# EAGLE board cyberspace-1-mainboard (EAGLE 9.6.2), part 1 of 2
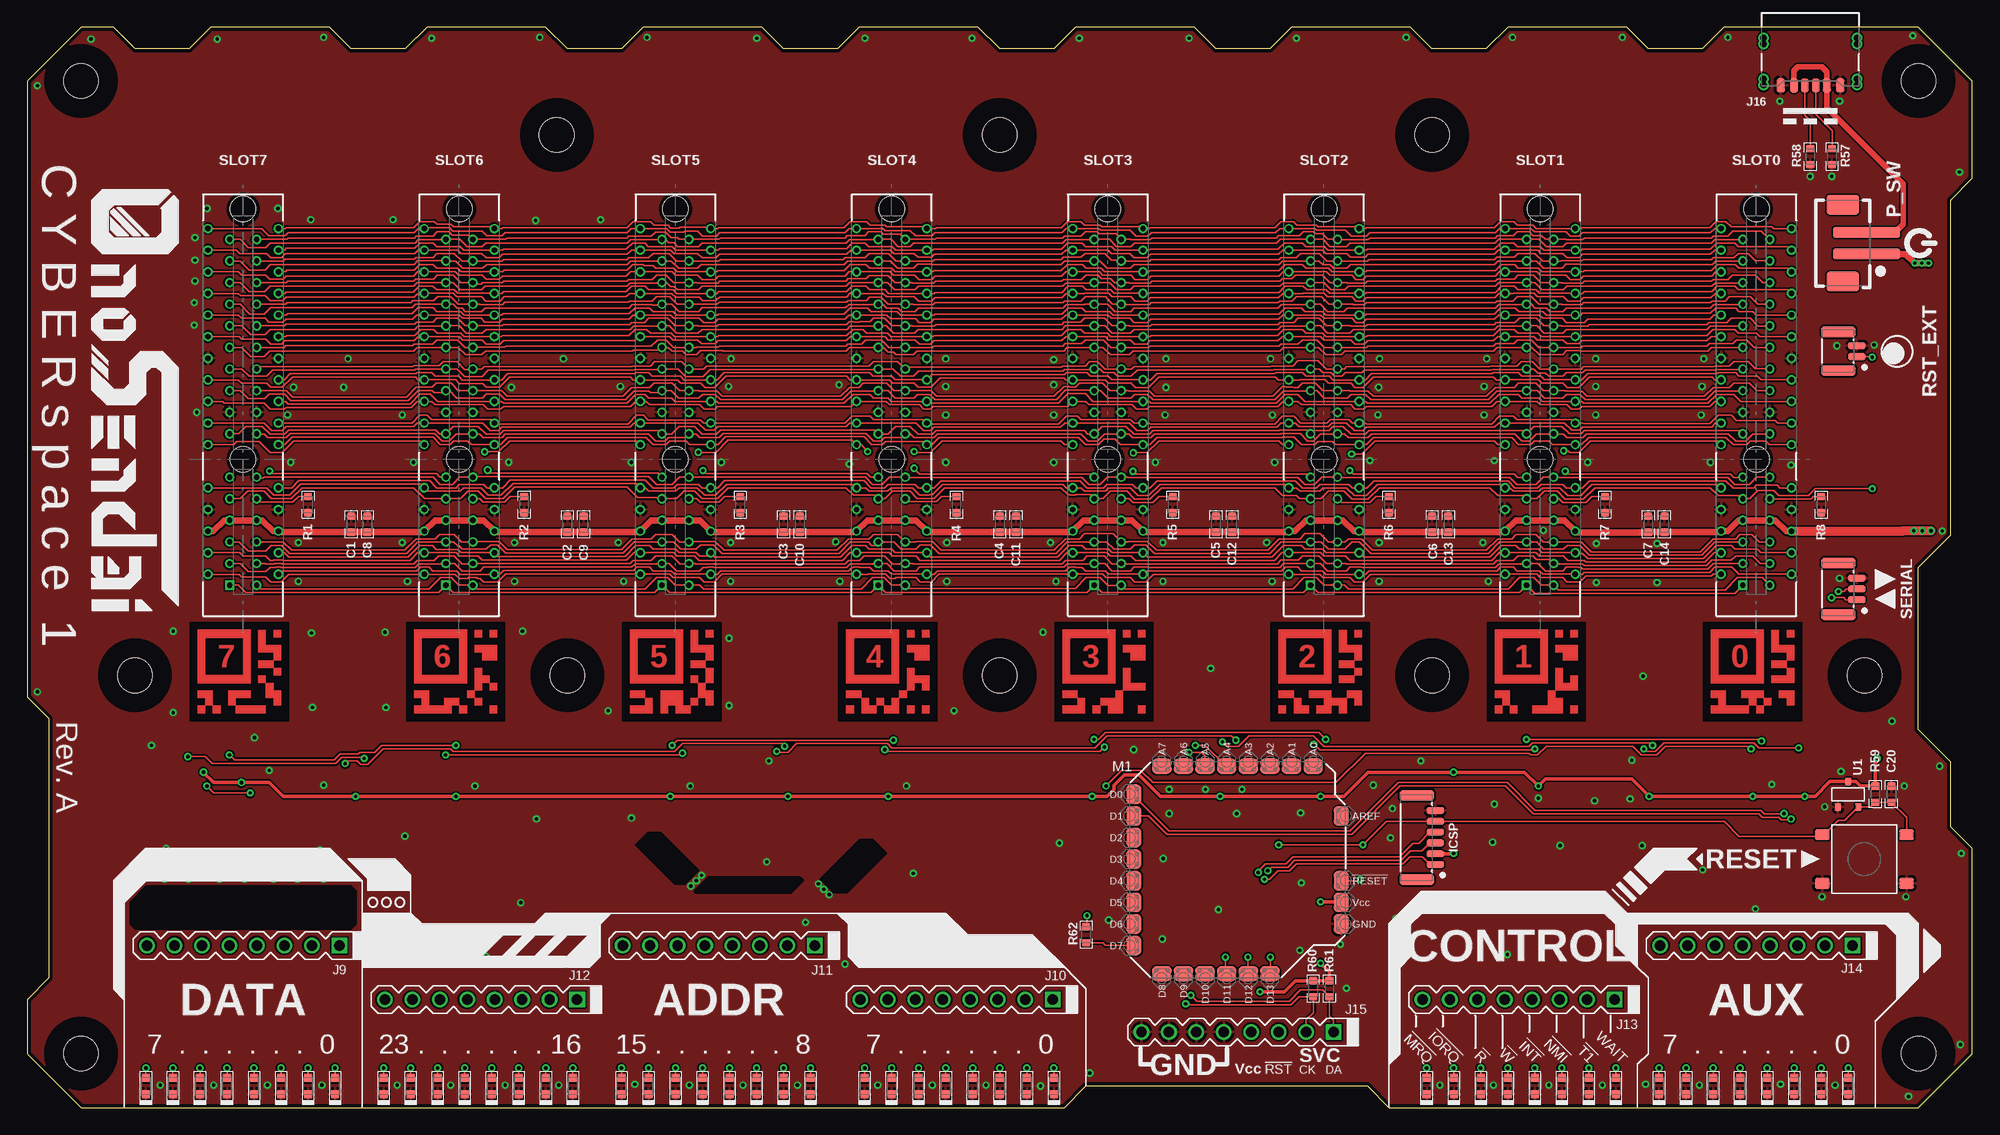
[diagram p1: board, top side]
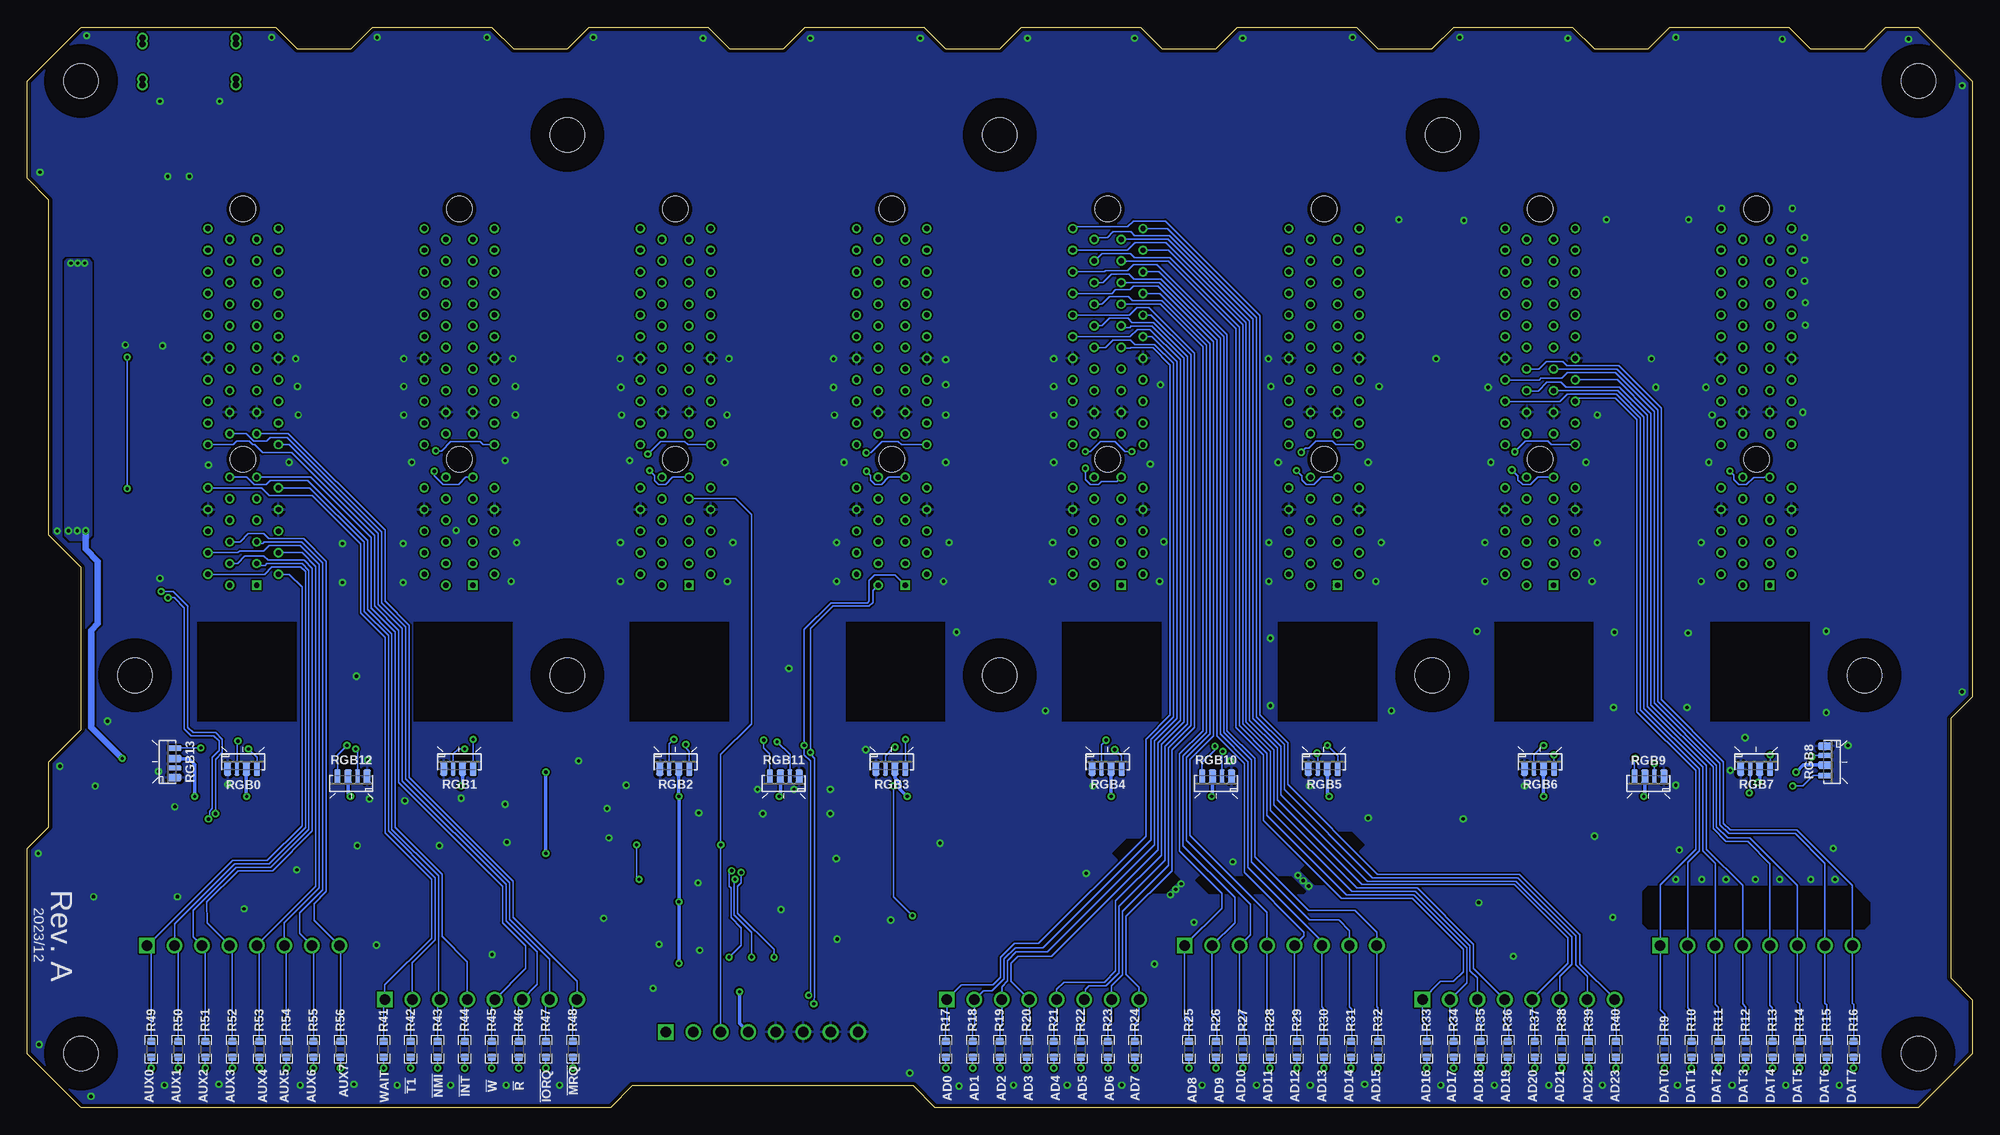
[diagram p2: board, bottom side, seen from below]

Size 180 x 100 mm. Coordinates in mm from the lower left corner, seen from the top.
Outline: 5,0 96,0 98,2 124,2 126,0 175,0 180,5 180,24 178,26 178,32 175,35 175,50 178,53 178,84 180,86 180,95 175,100 157,100 155,98 150,98 148,100 137,100 135,98 130,98 128,100 117,100 115,98 110,98 108,100 97,100 95,98 90,98 88,100 77,100 75,98 70,98 68,100 57,100 55,98 50,98 48,100 37,100 35,98 30,98 28,100 17,100 15,98 10,98 8,100 5,100 0,95 0,38 2,36 2,12 0,10 0,5 5,0
Copper layers (1*16): Top 0.0356mm / dielectric 1.5011mm / Bottom 0.0356mm
Design rules "OSH-CircuitMonkey *": minimum track width 6mil, minimum drill 12mil, track to track 6mil, track to pad 6mil, pad to pad 6mil, via to via 6mil, smd to smd 6mil, copper to edge 14mil, drill to drill 6mil, minimum pad ring 7mil, minimum via ring 7mil, stop-mask expansion 3mil, vias tented up to drill 13mil, thermal gap 10mil
Holes 3.2 mm at 5,95 175,95 175,5 5,5 50,40 90,40 130,40 170,40 10,40 130,90 90,90 49,90
tRestrict: area 6.6,36.6 to 13.4,43.4; area 1.6,1.6 to 8.4,8.4; area 1.6,91.6 to 8.4,98.4; area 45.6,86.6 to 52.4,93.4; area 86.6,86.6 to 93.4,93.4; area 126.6,86.6 to 133.4,93.4; area 171.6,91.6 to 178.4,98.4; area 166.6,36.6 to 173.4,43.4; area 126.6,36.6 to 133.4,43.4; area 86.6,36.6 to 93.4,43.4; area 46.6,36.6 to 53.4,43.4; area 171.6,1.6 to 178.4,8.4; 4 more areas
bRestrict: area 6.6,36.6 to 13.4,43.4; area 1.6,1.6 to 8.4,8.4; area 1.6,91.6 to 8.4,98.4; area 45.6,86.6 to 52.4,93.4; area 86.6,86.6 to 93.4,93.4; area 126.6,86.6 to 133.4,93.4; area 171.6,91.6 to 178.4,98.4; area 166.6,36.6 to 173.4,43.4; area 126.6,36.6 to 133.4,43.4; area 86.6,36.6 to 93.4,43.4; area 46.6,36.6 to 53.4,43.4; area 171.6,1.6 to 178.4,8.4; 4 more areas

## Footprints (pad centres in the part's own frame; a part is rotated, then mirrored left to right if it is on the bottom)
SMD_0603 = smd 0.8 x 0.8: A 0.75,0; K -0.75,0
0603-CAP = smd 0.711 x 0.762: 1 -0.752,0; 2 0.752,0
BM06B-SRSS-TB = smd 0.6 x 1.6: 1 -2.5,-0.3; 2 -1.5,-0.3; 3 -0.5,-0.3; 4 0.5,-0.3; 5 1.5,-0.3; 6 2.5,-0.3 | smd 1 x 3.2: MTG1 3.9,1.4; MTG2 -3.9,1.4
MA08X1-VT-THD = drill 0.965 square: 1 -8.89,0 | drill 0.965: 2 -6.35,0; 3 -3.81,0; 4 -1.27,0; 5 1.27,0; 6 3.81,0; 7 6.35,0; 8 8.89,0
GCT-USB4125 = smd 0.7 x 1.3: A5 -0.5,5.4; B5 0.5,5.4 | smd 0.75 x 1.3: A9 1.52,5.4; B9 -1.52,5.4 | smd 0.8 x 1.3: A12 2.75,5.4; B12 -2.75,5.4 | drill 0.6: MT1A -4.32,5.38; MT1B -4.32,4.82; MT2A 4.32,5.38; MT2B 4.32,4.82; MT3A -4.32,1.58; MT3B -4.32,1.02; MT4A 4.32,1.58; MT4B 4.32,1.02
0119A = smd 1.4 x 1.8: !RESET 9.6,-1; AREF 9.6,5; D0 -9.6,7; D1 -9.6,5; D2 -9.6,3; D3 -9.6,1; D4 -9.6,-1; D5 -9.6,-3; D6 -9.6,-5; D7 -9.6,-7; GND 9.6,-5; VCC 9.6,-3 | smd 1.8 x 1.4: A0 7,9.6; A1 5,9.6; A2 3,9.6; A3 1,9.6; A4 -1,9.6; A5 -3,9.6; A6 -5,9.6; A7 -7,9.6; D8 -7,-9.6; D9 -5,-9.6; D10 -3,-9.6; D11 -1,-9.6; D12 1,-9.6; D13 3,-9.6
B2B-PH-SM4 = smd 1 x 6.2: 1 -1,-2.2; 2 1,-2.2 | smd 1.8 x 3: GND@MT1 3.55,0; GND@MT2 -3.55,0
0603-RES = smd 0.711 x 0.762: 1 -0.752,0; 2 0.752,0
B3FS = smd 1.4 x 1: 1 3.9,-2.25; 2 -3.9,-2.25; 3 3.9,2.25; 4 -3.9,2.25
SMD_4020 = smd 0.55 x 1.3: 1 1.275,-0.65 | smd 0.7 x 1.3: 2 0.3,-0.65; 4 -1.45,-0.65 | smd 0.45 x 1.3: 3 -0.575,-0.65
BM02B-SRSS-TB = smd 0.6 x 1.6: 1 -0.5,-0.3; 2 0.5,-0.3 | smd 1 x 3.2: MTG1 1.8,1.4; MTG2 -1.8,1.4
BM03B-SRSS-TB = smd 0.6 x 1.6: 1 -1,-0.3; 2 0,-0.3; 3 1,-0.3 | smd 1 x 3.2: MTG1 2.4,1.4; MTG2 -2.4,1.4
PCIE-64P-SOCKET = drill 0.5 square: A1 -11.65,1.25 | drill 0.5: A2 -10.65,3.25; A3 -9.65,1.25; A4 -8.65,3.25; A5 -7.65,1.25; A6 -6.65,3.25; A7 -5.65,1.25; A8 -4.65,3.25; A9 -3.65,1.25; A10 -2.65,3.25; A11 -1.65,1.25; A12 1.35,3.25; A13 2.35,1.25; A14 3.35,3.25; A15 4.35,1.25; A16 5.35,3.25; A17 6.35,1.25; A18 7.35,3.25; A19 8.35,1.25; A20 9.35,3.25; A21 10.35,1.25; A22 11.35,3.25; A23 12.35,1.25; A24 13.35,3.25; A25 14.35,1.25; A26 15.35,3.25; A27 16.35,1.25; A28 17.35,3.25; A29 18.35,1.25; A30 19.35,3.25; A31 20.35,1.25; A32 21.35,3.25; B1 -11.65,-1.25; B2 -10.65,-3.25; B3 -9.65,-1.25; B4 -8.65,-3.25; B5 -7.65,-1.25; B6 -6.65,-3.25; B7 -5.65,-1.25; B8 -4.65,-3.25; B9 -3.65,-1.25; B10 -2.65,-3.25; B11 -1.65,-1.25; B12 1.35,-3.25; B13 2.35,-1.25; B14 3.35,-3.25; B15 4.35,-1.25; B16 5.35,-3.25; B17 6.35,-1.25; B18 7.35,-3.25; B19 8.35,-1.25; B20 9.35,-3.25; B21 10.35,-1.25; B22 11.35,-3.25; B23 12.35,-1.25; B24 13.35,-3.25; B25 14.35,-1.25; B26 15.35,-3.25; B27 16.35,-1.25; B28 17.35,-3.25; B29 18.35,-1.25; B30 19.35,-3.25; B31 20.35,-1.25; B32 21.35,-3.25 | hole 2.35: 0,0; 23.15,0
SOT-23 = smd 0.6 x 0.7: 1 -0.95,-1.18; 2 0.95,-1.18; 3 0,1.18

## Placement (x,y rotation side)
!INT  BLU  [SMD_0603]  139.5,2 90 top
!IORQ  BLU  [SMD_0603]  132,2 90 top
!MRQ  BLU  [SMD_0603]  129.5,2 90 top
!NMI  BLU  [SMD_0603]  142,2 90 top
!R  BLU  [SMD_0603]  134.5,2 90 top
!T1  BLU  [SMD_0603]  144.5,2 90 top
!W  BLU  [SMD_0603]  137,2 90 top
AD0  BLU  [SMD_0603]  95,2 90 top
AD1  BLU  [SMD_0603]  92.5,2 90 top
AD2  BLU  [SMD_0603]  90,2 90 top
AD3  BLU  [SMD_0603]  87.5,2 90 top
AD4  BLU  [SMD_0603]  85,2 90 top
AD5  BLU  [SMD_0603]  82.5,2 90 top
AD6  BLU  [SMD_0603]  80,2 90 top
AD7  BLU  [SMD_0603]  77.5,2 90 top
AD8  BLU  [SMD_0603]  72.5,2 90 top
AD9  BLU  [SMD_0603]  70,2 90 top
AD10  BLU  [SMD_0603]  67.5,2 90 top
AD11  BLU  [SMD_0603]  65,2 90 top
AD12  BLU  [SMD_0603]  62.5,2 90 top
AD13  BLU  [SMD_0603]  60,2 90 top
AD14  BLU  [SMD_0603]  57.5,2 90 top
AD15  BLU  [SMD_0603]  55,2 90 top
AD16  BLU  [SMD_0603]  50.5,2 90 top
AD17  BLU  [SMD_0603]  48,2 90 top
AD18  BLU  [SMD_0603]  45.5,2 90 top
AD19  BLU  [SMD_0603]  43,2 90 top
AD20  BLU  [SMD_0603]  40.5,2 90 top
AD21  BLU  [SMD_0603]  38,2 90 top
AD22  BLU  [SMD_0603]  35.5,2 90 top
AD23  BLU  [SMD_0603]  33,2 90 top
AUX0  BLU  [SMD_0603]  168.5,2 90 top
AUX1  BLU  [SMD_0603]  166,2 90 top
AUX2  BLU  [SMD_0603]  163.5,2 90 top
AUX3  BLU  [SMD_0603]  161,2 90 top
AUX4  BLU  [SMD_0603]  158.5,2 90 top
AUX5  BLU  [SMD_0603]  156,2 90 top
AUX6  BLU  [SMD_0603]  153.5,2 90 top
AUX7  BLU  [SMD_0603]  151,2 90 top
C1  1uF  [0603-CAP]  30,54 90 top
C2  1uF  [0603-CAP]  50,54 90 top
C3  1uF  [0603-CAP]  70,54 90 top
C4  1uF  [0603-CAP]  90,54 90 top
C5  1uF  [0603-CAP]  110,54 90 top
C6  1uF  [0603-CAP]  130,54 90 top
C7  1uF  [0603-CAP]  150,54 90 top
C8  0.1uF  [0603-CAP]  31.5,54 90 top
C9  0.1uF  [0603-CAP]  51.5,54 90 top
C10  0.1uF  [0603-CAP]  71.5,54 90 top
C11  0.1uF  [0603-CAP]  91.5,54 90 top
C12  0.1uF  [0603-CAP]  111.5,54 90 top
C13  0.1uF  [0603-CAP]  131.5,54 90 top
C14  0.1uF  [0603-CAP]  151.5,54 90 top
C20  0.1uF  [0603-CAP]  172.5,29 90 top
DAT0  VIO  [SMD_0603]  28.5,2 90 top
DAT1  VIO  [SMD_0603]  26,2 90 top
DAT2  VIO  [SMD_0603]  23.5,2 90 top
DAT3  VIO  [SMD_0603]  21,2 90 top
DAT4  VIO  [SMD_0603]  18.5,2 90 top
DAT5  VIO  [SMD_0603]  16,2 90 top
DAT6  VIO  [SMD_0603]  13.5,2 90 top
DAT7  VIO  [SMD_0603]  11,2 90 top
ICSP  Connector, 6P, SM, VT  [BM06B-SRSS-TB]  130,25 90 top
J9  Header, 8-pin  [MA08X1-VT-THD]  20,15 180 top
J10  Header, 8-pin  [MA08X1-VT-THD]  86,10 180 top
J11  Header, 8-pin  [MA08X1-VT-THD]  64,15 180 top
J12  Header, 8-pin  [MA08X1-VT-THD]  42,10 180 top
J13  Header, 8-pin  [MA08X1-VT-THD]  138,10 180 top
J14  Header, 8-pin  [MA08X1-VT-THD]  160,15 180 top
J15  Header, 8-pin  [MA08X1-VT-THD]  112,7 180 top
J16  USB-C, Power  [GCT-USB4125]  165,100 180 top
M1  ATmega328P Module  [0119A]  112,22 0 top
P_SW  2-pin, VT, SMT  [B2B-PH-SM4]  168,80 90 top
QR00  QR_CODE-00-7MM  [QR-7MM-00]  160,40 0 top
QR01  QR_CODE-01-7MM  [QR-7MM-01]  140,40 0 top
QR02  QR_CODE-02-7MM  [QR-7MM-02]  120,40 0 top
QR03  QR_CODE-03-7MM  [QR-7MM-03]  100,40 0 top
QR04  QR_CODE-04-7MM  [QR-7MM-04]  80,40 0 top
QR05  QR_CODE-05-7MM  [QR-7MM-05]  60,40 0 top
QR06  QR_CODE-06-7MM  [QR-7MM-06]  40,40 0 top
QR07  QR_CODE-07-7MM  [QR-7MM-07]  20,40 0 top
R1  1K  [0603-RES]  26,55.8 270 top
R2  1K  [0603-RES]  46,55.8 270 top
R3  1K  [0603-RES]  66,55.8 270 top
R4  1K  [0603-RES]  86,55.8 270 top
R5  1K  [0603-RES]  106,55.8 270 top
R6  1K  [0603-RES]  126,55.8 270 top
R7  1K  [0603-RES]  146,55.8 270 top
R8  1K  [0603-RES]  166,55.8 270 top
R9  2K  [0603-RES]  28.5,5.4 270 bottom
R10  2K  [0603-RES]  26,5.4 270 bottom
R11  2K  [0603-RES]  23.5,5.4 270 bottom
R12  2K  [0603-RES]  21,5.4 270 bottom
R13  2K  [0603-RES]  18.5,5.4 270 bottom
R14  2K  [0603-RES]  16,5.4 270 bottom
R15  2K  [0603-RES]  13.5,5.4 270 bottom
R16  2K  [0603-RES]  11,5.4 270 bottom
R17  2K  [0603-RES]  95,5.4 270 bottom
R18  2K  [0603-RES]  92.5,5.4 270 bottom
R19  2K  [0603-RES]  90,5.4 270 bottom
R20  2K  [0603-RES]  87.5,5.4 270 bottom
R21  2K  [0603-RES]  85,5.4 270 bottom
R22  2K  [0603-RES]  82.5,5.4 270 bottom
R23  2K  [0603-RES]  80,5.4 270 bottom
R24  2K  [0603-RES]  77.5,5.4 270 bottom
R25  2K  [0603-RES]  72.5,5.4 270 bottom
R26  2K  [0603-RES]  70,5.4 270 bottom
R27  2K  [0603-RES]  67.5,5.4 270 bottom
R28  2K  [0603-RES]  65,5.4 270 bottom
R29  2K  [0603-RES]  62.5,5.4 270 bottom
R30  2K  [0603-RES]  60,5.4 270 bottom
R31  2K  [0603-RES]  57.5,5.4 270 bottom
R32  2K  [0603-RES]  55,5.4 270 bottom
R33  2K  [0603-RES]  50.5,5.4 270 bottom
R34  2K  [0603-RES]  48,5.4 270 bottom
R35  2K  [0603-RES]  45.5,5.4 270 bottom
R36  2K  [0603-RES]  43,5.4 270 bottom
R37  2K  [0603-RES]  40.5,5.4 270 bottom
R38  2K  [0603-RES]  38,5.4 270 bottom
R39  2K  [0603-RES]  35.5,5.4 270 bottom
R40  2K  [0603-RES]  33,5.4 270 bottom
R41  2K  [0603-RES]  147,5.4 270 bottom
R42  2K  [0603-RES]  144.5,5.4 270 bottom
R43  2K  [0603-RES]  142,5.4 270 bottom
R44  2K  [0603-RES]  139.5,5.4 270 bottom
R45  2K  [0603-RES]  137,5.4 270 bottom
R46  2K  [0603-RES]  134.5,5.4 270 bottom
R47  2K  [0603-RES]  132,5.4 270 bottom
R48  2K  [0603-RES]  129.5,5.4 270 bottom
R49  2K  [0603-RES]  168.5,5.4 270 bottom
R50  2K  [0603-RES]  166,5.4 270 bottom
R51  2K  [0603-RES]  163.5,5.4 270 bottom
R52  2K  [0603-RES]  161,5.4 270 bottom
R53  2K  [0603-RES]  158.5,5.4 270 bottom
R54  2K  [0603-RES]  156,5.4 270 bottom
R55  2K  [0603-RES]  153.5,5.4 270 bottom
R56  2K  [0603-RES]  151,5.4 270 bottom
R57  5.1K  [0603-RES]  167,88 90 top
R58  5.1K  [0603-RES]  165,88 90 top
R59  10K  [0603-RES]  171,29 90 top
R60  10K  [0603-RES]  119,11 90 top
R61  10K  [0603-RES]  120.5,11 90 top
R62  300  [0603-RES]  98,16 90 top
RESET  Tact. Sw.  [B3FS]  170,23 180 top
RGB0  [SMD_4020]  160,32 0 bottom
RGB1  [SMD_4020]  140,32 0 bottom
RGB2  [SMD_4020]  120,32 0 bottom
RGB3  [SMD_4020]  100,32 0 bottom
RGB4  [SMD_4020]  80,32 0 bottom
RGB5  [SMD_4020]  60,32 0 bottom
RGB6  [SMD_4020]  40,32 0 bottom
RGB7  [SMD_4020]  20,32 0 bottom
RGB8  [SMD_4020]  13,32 270 bottom
RGB9  [SMD_4020]  30,30 180 bottom
RGB10  [SMD_4020]  70,30 180 bottom
RGB11  [SMD_4020]  110,30 180 bottom
RGB12  [SMD_4020]  150,30 180 bottom
RGB13  [SMD_4020]  167,32 90 bottom
RST_EXT  JST, SH, 2P  [BM02B-SRSS-TB]  169,70 90 top
SERIAL  JST SM 3P  [BM03B-SRSS-TB]  169,48 90 top
SLOT0  Card Edge Socket, 64P  [PCIE-64P-SOCKET]  160,60 90 top
SLOT1  Card Edge Socket, 64P  [PCIE-64P-SOCKET]  140,60 90 top
SLOT2  Card Edge Socket, 64P  [PCIE-64P-SOCKET]  120,60 90 top
SLOT3  Card Edge Socket, 64P  [PCIE-64P-SOCKET]  100,60 90 top
SLOT4  Card Edge Socket, 64P  [PCIE-64P-SOCKET]  80,60 90 top
SLOT5  Card Edge Socket, 64P  [PCIE-64P-SOCKET]  60,60 90 top
SLOT6  Card Edge Socket, 64P  [PCIE-64P-SOCKET]  40,60 90 top
SLOT7  Card Edge Socket, 64P  [PCIE-64P-SOCKET]  20,60 90 top
U1  RESET CKT  [SOT-23]  168.5,29 0 top
WAIT  BLU  [SMD_0603]  147,2 90 top

## Tracks (layer width: path | path; a pad name or v marks a point on that pad's centre or on a via)
!CLK
  Top 0.152: SLOT7.B14 23.27,63.37 35.61,63.37 36.32,64.08 37.04,64.08 37.44,63.68 42.92,63.68 SLOT6.B14 43.33,63.27 43.51,63.27 43.52,63.28 55.6,63.28 56.4,64.08 57.04,64.08 57.47,63.65 62.31,63.65 62.61,63.35 SLOT5.B14 63.59,63.35 63.6,63.36 75.68,63.36 76.33,64.01 77.99,64.01 78.32,63.68 82.92,63.68 SLOT4.B14 83.33,63.27 83.91,63.27 83.92,63.28 95.44,63.28 96.17,64.01 97.19,64.01 97.52,63.68 102.08,63.68 102.41,63.35 SLOT3.B14 103.85,63.35 103.92,63.28 115.44,63.28 116.16,64 116.47,64 116.48,64.01 117.02,64.01 117.03,64 117.2,64 117.84,63.36 120.29,63.36 120.59,63.66 122.31,63.66 122.63,63.35 SLOT2.B14 123.87,63.35 123.94,63.28 135.52,63.28 136.24,64 136.47,64 136.48,64.01 137.02,64.01 137.03,64 137.52,64 137.84,63.68 142.92,63.68 SLOT1.B14 143.43,63.35 143.44,63.36 143.96,63.36 144.02,63.3 155.7,63.3 156.48,64.08 157.68,64.08 158.16,63.6 161.76,63.6 162.01,63.35 SLOT0.B14
!INT  (via drill 0.3, 0.35)
  Top 0.152: SLOT6.A11 38.19,58.35 37.88,58.66 22.68,58.66 v22.44,58.9 | v42.62,59 42.9,58.72 58.38,58.72 SLOT5.A11 | v62.54,58.96 62.82,58.68 77.72,58.68 78.05,58.35 SLOT4.A11 | v82.08,59.16 82.6,58.64 98.46,58.64 SLOT3.A11 | v102.32,58.88 102.56,58.64 118.46,58.64 SLOT2.A11 | SLOT1.A11 138.72,58.32 137.92,58.32 137.6,58.64 122.72,58.64 v122.4,58.96 | v142.32,58.88 142.56,58.64 157.6,58.64 157.92,58.32 158.72,58.32 SLOT0.A11
  Bottom 0.152: v22.44,58.9 22.08,58.54 22.08,58.12 21.6,57.64 20.92,57.64 20.24,58.32 19.28,58.32 19.25,58.35 SLOT7.A11 | SLOT6.A11 40.23,58.35 40.9,57.68 41.62,57.68 42.04,58.1 42.04,58.44 42.6,59 v42.62,59 | SLOT5.A11 60.25,58.35 60.92,57.68 61.64,57.68 62.04,58.08 62.04,58.46 v62.54,58.96 | SLOT4.A11 79.17,57.93 80.61,57.93 80.86,57.68 81.62,57.68 82.08,58.14 v82.08,59.16 | SLOT3.A11 100.29,58.35 100.96,57.68 101.52,57.68 101.94,58.1 101.94,58.5 v102.32,58.88 | SLOT1.A11 139.41,58.35 140.08,57.68 141.52,57.68 142.32,58.48 v142.32,58.88 | SLOT2.A11 120.25,58.35 120.92,57.68 121.58,57.68 121.94,58.04 121.94,58.5 v122.4,58.96 | SLOT0.A11 153.76,58.35 148.18,52.77 148.18,46.26 145.92,44 145.92,25.92 141.6,21.6 141.6,15.84 139.27,13.51 J13.4 139.5,9.77 R44.1
!IORQ
  Top 0.152: SLOT7.B13 21.94,62.35 22.29,62 22.97,62 22.98,62.01 23.52,62.01 23.53,62 24,62 24.36,62.36 37.72,62.36 38.39,61.69 39.04,61.69 39.7,62.35 SLOT6.B13 41.89,62.35 42.22,62.02 43.94,62.02 44.24,62.32 57.52,62.32 58.16,61.68 59.02,61.68 59.35,62.01 60.91,62.01 SLOT5.B13 61.89,62.35 62.22,62.02 64.02,62.02 64.4,62.4 76.34,62.4 76.36,62.38 77.61,62.38 78.32,61.68 79.02,61.68 79.33,61.99 80.89,61.99 SLOT4.B13 81.73,62.35 82.08,62 82.97,62 82.98,62.01 83.52,62.01 83.53,62 83.92,62 84.24,62.32 97.52,62.32 98.15,61.69 99.03,61.69 99.69,62.35 SLOT3.B13 101.94,62.35 102.27,62.02 103.98,62.02 104,62 104.32,62.32 116,62.32 116.04,62.36 117.8,62.36 118.48,61.68 119.02,61.68 119.69,62.35 SLOT2.B13 121.89,62.35 122.24,62 122.97,62 122.98,62.01 123.52,62.01 123.53,62 124.08,62 124.4,62.32 137.68,62.32 138.32,61.68 139.02,61.68 139.66,62.32 141.22,62.32 SLOT1.B13 142.13,62.35 142.46,62.02 143.94,62.02 144.26,62.34 157.42,62.34 158.08,61.68 159.02,61.68 159.69,62.35 SLOT0.B13
  Bottom 0.152: SLOT0.B13 159.7,62.36 159.02,61.68 157.84,61.68 157.51,62.01 155.93,62.01 147.2,53.28 147.2,46.72 144.96,44.48 144.96,30.4 135.36,20.8 135.36,17.44 131.65,13.73 J13.7 132,9.65 R47.1
!MRQ
  Top 0.152: SLOT7.A13 18.8,62.4 19.6,62.4 20.24,63.04 21.76,63.04 22.48,62.32 23.84,62.32 24.2,62.69 37.83,62.69 38.16,62.35 SLOT6.A13 39.44,63.04 41.76,63.04 42.46,62.34 43.78,62.34 44.08,62.64 58.46,62.64 SLOT5.A13 59.65,62.35 60.32,63.02 61.78,63.02 62.46,62.34 63.78,62.34 64.16,62.72 76.45,62.72 76.48,62.69 77.02,62.69 77.05,62.72 78.38,62.72 SLOT4.A13 79.67,62.35 80.36,63.04 81.7,63.04 82.42,62.32 83.76,62.32 84.08,62.64 97.82,62.64 98.11,62.35 SLOT3.A13 99.44,63.04 101.68,63.04 102.4,62.32 103.84,62.32 104.16,62.64 115.84,62.64 115.88,62.68 118.44,62.68 118.56,62.56 118.72,62.32 SLOT2.A13 118.8,62.35 119.1,62.66 120.45,62.66 120.83,63.04 121.76,63.04 122.48,62.32 123.84,62.32 124.16,62.64 138.46,62.64 SLOT1.A13 139.44,63.04 142,63.04 142.68,62.36 143.8,62.36 144.1,62.66 158.46,62.66 158.75,62.37 SLOT0.A13
  Bottom 0.152: SLOT0.A13 158.7,62.4 155.84,62.4 146.88,53.44 146.88,46.88 144.64,44.64 144.64,30.56 135.04,20.96 135.04,17.6 129.11,11.67 J13.8 129.5,9.61 R48.1
!NMI
  Top 0.152: SLOT7.B11 21.33,58.27 21.87,58.27 21.94,58.34 37.58,58.34 38.24,57.68 39.38,57.68 40.05,58.35 SLOT6.B11 41.57,58.35 41.62,58.4 57.52,58.4 58.24,57.68 59.7,57.68 60.37,58.35 SLOT5.B11 77.57,58.35 78.24,57.68 79.12,57.68 79.79,58.35 SLOT4.B11 81.49,58.35 81.52,58.32 97.6,58.32 98.24,57.68 99.28,57.68 99.95,58.35 SLOT3.B11 101.81,58.35 101.84,58.32 117.6,58.32 118.24,57.68 119.12,57.68 119.79,58.35 SLOT2.B11 121.28,58.32 137.2,58.32 137.84,57.68 139.62,57.68 140.29,58.35 SLOT1.B11 141.49,58.35 141.52,58.32 157.36,58.32 158,57.68 159.36,57.68 160.03,58.35 SLOT0.B11
  Bottom 0.152: SLOT0.B11 159.68,58.35 158.98,57.66 157.87,57.66 157.5,58.02 154.02,58.02 148.48,52.48 148.48,46.08 146.24,43.84 146.24,25.76 141.92,21.44 141.92,10.11 J13.3 142,9.81 R43.1
!R  (via drill 0.3)
  Top 0.152: SLOT7.A12 19.13,61.36 19.4,61.63 21.49,61.63 22.48,60.64 23.6,60.64 24.66,61.7 36.4,61.7 SLOT6.A12 | v42.35,60.69 43.65,60.69 44.64,61.68 56.42,61.68 SLOT5.A12 | v62.1,60.64 63.76,60.64 64.88,61.76 76.34,61.76 SLOT4.A12 77.15,61.35 v77.78,60.72 | v82.08,60.72 82.16,60.64 83.6,60.64 84.64,61.68 95.68,61.68 96,61.36 SLOT3.A12 | SLOT2.A12 116.17,61.35 115.84,61.68 104.72,61.68 103.64,60.6 v102.36,60.6 | v122.56,60.48 123.52,60.48 124.72,61.68 135.76,61.68 136.09,61.35 SLOT1.A12 | SLOT0.A12 156.42,61.68 144.64,61.68 143.6,60.64 142.74,60.64 142.6,60.78 v142.18,60.78
  Bottom 0.152: v62.1,60.64 61.7,61.04 61.4,61.04 60.76,61.68 59.24,61.68 58.91,61.35 SLOT5.A12 | v77.78,60.72 78.4,60.72 79.32,61.64 80.68,61.64 81.6,60.72 v82.08,60.72 | SLOT2.A12 118.85,61.35 119.14,61.64 121.4,61.64 v122.56,60.48 | SLOT1.A12 137.79,61.35 138.07,61.63 140.79,61.63 141.64,60.78 v142.18,60.78 | SLOT6.A12 38.95,61.35 39.28,61.68 41.36,61.68 v42.35,60.69 | SLOT0.A12 155.75,61.35 147.52,53.12 147.52,46.56 145.28,44.32 145.28,30.24 135.68,20.64 135.68,17.28 132.8,14.4 132.8,11.39 J13.6 134.5,9.69 R46.1 | SLOT3.A12 99.11,61.35 99.4,61.64 100.88,61.64 101.92,60.6 v102.36,60.6
!RST  (via drill 0.3)
  Top 0.152: SLOT7.A9 19.71,56.35 20.4,57.04 21.92,57.04 22.6,56.36 24.45,56.36 25.45,57.36 35.76,57.36 36.77,56.35 SLOT6.A9 40.11,56.35 40.8,57.04 41.76,57.04 42.45,56.35 44.03,56.35 45.12,57.44 55.52,57.44 56.48,56.48 58.62,56.48 SLOT5.A9 60.11,56.35 60.8,57.04 61.76,57.04 62.44,56.36 63.88,56.36 64.84,57.32 75.8,57.32 76.45,56.67 78.43,56.67 SLOT4.A9 79.39,56.35 80.08,57.04 81.68,57.04 82.33,56.38 83.94,56.38 84.91,57.36 95.68,57.36 96.32,56.72 96.45,56.72 96.48,56.69 97.02,56.69 97.05,56.72 98.38,56.72 SLOT3.A9 99.55,56.35 100.24,57.04 101.76,57.04 102.48,56.32 103.92,56.32 104.96,57.36 115.44,57.36 116.16,56.64 117.44,56.64 117.73,56.35 SLOT2.A9 119.71,56.35 120.4,57.04 121.84,57.04 122.56,56.32 124.08,56.32 125.12,57.36 135.36,57.36 136.08,56.64 138.46,56.64 SLOT1.A9 139.71,56.35 140.4,57.04 141.6,57.04 142.31,56.34 144.01,56.34 145.04,57.36 155.76,57.36 156.48,56.64 158.46,56.64 SLOT0.A9 159.39,56.35 160.16,57.12 161.6,57.12 162.08,56.64 164.8,56.64 165.44,57.28 v170.72,57.28 | v123.36,21.12 123.24,21 M1.!RESET | RESET.2 173.9,26.85 C20.1 R59.1 170.59,27.84 169.47,27.84 U1.2 168.19,26.56 167.57,26.56 166.26,25.25 RESET.1 165.97,25.12 158.4,25.12 157.02,26.5 ICSP.5 125.78,26.5 v123.6,24.32 v115.81,24.32 | v170.72,69.44 170.48,69.44 170.42,69.5 RST_EXT.1
  Bottom 0.152: J15.3 v115.81,24.32 115.81,32.67 112.98,35.5 112.98,54.9 114.43,56.35 SLOT2.A9 | v123.6,24.32 123.6,21.36 v123.36,21.12 | v170.72,69.44 v170.72,57.28
!T1
  Top 0.152: SLOT7.A10 22.17,57.35 22.84,56.68 24.28,56.68 25.3,57.7 36.4,57.7 SLOT6.A10 36.8,57.36 37.12,57.04 40.08,57.04 40.4,57.36 42,57.36 42.68,56.68 43.88,56.68 44.96,57.76 56.4,57.76 56.75,57.41 SLOT5.A10 57.21,57.35 57.52,57.04 60,57.04 60.32,57.36 62,57.36 62.68,56.68 63.72,56.68 64.72,57.68 76.4,57.68 76.72,57.36 SLOT4.A10 77.61,57.35 77.92,57.04 79.6,57.04 79.92,57.36 81.92,57.36 82.59,56.69 83.52,56.69 83.55,56.72 83.76,56.72 84.71,57.67 95.87,57.67 96.19,57.35 SLOT3.A10 97.53,57.35 97.84,57.04 99.76,57.04 100.08,57.36 102.08,57.36 102.8,56.64 103.76,56.64 104.8,57.68 116.42,57.68 SLOT2.A10 117.44,57.36 117.76,57.04 119.6,57.04 119.92,57.36 122.08,57.36 122.8,56.64 123.92,56.64 124.96,57.68 136.42,57.68 SLOT1.A10 137.21,57.35 137.52,57.04 139.92,57.04 140.24,57.36 141.84,57.36 142.56,56.64 143.76,56.64 144.8,57.68 156.34,57.68 156.67,57.35 SLOT0.A10
  Bottom 0.152: SLOT0.A10 153.83,57.35 148.8,52.32 148.8,45.92 146.56,43.68 146.56,25.6 142.24,21.28 142.24,15.52 144.35,13.41 J13.2 144.5,9.85 R42.1
!W
  Top 0.152: SLOT7.B12 23.84,61.36 24.52,62.04 37.56,62.04 38.22,61.38 39.17,61.38 39.48,61.69 40.79,61.69 41.13,61.35 SLOT6.B12 43.83,61.35 44.48,62 56.16,62 56.17,62.01 57.27,62.01 57.92,61.36 59.14,61.36 59.46,61.68 60.96,61.68 61.29,61.35 SLOT5.B12 63.92,61.36 64.64,62.08 77.44,62.08 78.16,61.36 79.14,61.36 79.42,61.64 82.96,61.64 SLOT4.B12 83.75,61.35 84.4,62 96.47,62 96.48,62.01 97.02,62.01 97.03,62 97.28,62 97.92,61.36 99.14,61.36 99.66,61.88 100.64,61.88 101.16,61.36 SLOT3.B12 103.91,61.35 104.56,62 116.16,62 116.2,62.04 117.24,62.04 117.92,61.36 119.14,61.36 119.44,61.66 120.76,61.66 121.06,61.36 SLOT2.B12 123.91,61.35 124.56,62 136.4,62 136.41,62.01 137.02,62.01 137.03,62 137.36,62 138,61.36 139.14,61.36 139.46,61.68 140.8,61.68 141.12,61.36 SLOT1.B12 143.83,61.35 144.5,62.02 157.2,62.02 157.86,61.36 159.14,61.36 159.46,61.68 160.86,61.68 161.18,61.36 SLOT0.B12
  Bottom 0.152: SLOT0.B12 160.93,61.35 160.6,61.68 159.46,61.68 159.14,61.36 158.94,61.36 158.2,60.62 155.5,60.62 147.84,52.96 147.84,46.4 145.6,44.16 145.6,30.08 136,20.48 136,17.12 133.85,14.97 133.85,12.88 J13.5 137,9.73 R45.1
A0
  Top 0.152: SLOT7.A21 19.87,70.35 20.7,69.52 21.94,69.52 22.44,70.02 35.78,70.02 36.08,70.32 38.72,70.32 SLOT6.A21 39.89,70.35 40.56,69.68 42.08,69.68 42.42,70.02 56.02,70.02 56.11,70.11 58.51,70.11 SLOT5.A21 59.33,70.35 59.68,70 60.64,70 60.96,69.68 61.96,69.68 62.32,70.04 64.36,70.04 64.4,70 75.76,70 76.09,70.33 77.33,70.33 77.34,70.35 SLOT4.A21 79.25,70.35 79.68,69.92 80.16,69.92 80.4,69.68 82.04,69.68 82.37,70.01 83.52,70.01 83.53,70 95.92,70 96.24,70.32 98.72,70.32 SLOT3.A21 99.57,70.35 100.24,69.68 102,69.68 102.33,70.01 103.52,70.01 103.53,70 115.92,70 116.24,70.32 118.72,70.32 SLOT2.A21 119.49,70.35 120.16,69.68 121.6,69.68 121.92,70 122.97,70 122.98,70.01 123.52,70.01 123.53,70 135.68,70 136,70.32 138.72,70.32 SLOT1.A21 139.25,70.35 139.92,69.68 142.08,69.68 142.44,70.04 143.68,70.04 143.72,70 155.52,70 155.84,70.32 158.72,70.32 SLOT0.A21
  Bottom 0.152: SLOT4.A21 78.67,70.27 77.89,70.27 77.84,70.32 75.84,70.32 74.24,68.72 74.24,36.32 76.48,34.08 76.48,25.12 86.4,15.2 88.64,15.2 89.92,13.92 89.92,12.08 90.64,11.36 93.53,11.36 J10.1 94.89,7.67 95.04,7.52 95.04,6.19 R17.1
A1
  Top 0.152: SLOT7.B21 23.79,70.35 23.94,70.5 35.7,70.5 35.84,70.64 37.52,70.64 37.92,71.04 39.84,71.04 40.53,70.35 SLOT6.B21 41.33,70.27 41.39,70.27 41.48,70.36 44.2,70.36 44.32,70.48 57.76,70.48 58.32,71.04 59.12,71.04 59.81,70.35 SLOT5.B21 61.95,70.35 61.96,70.36 63.96,70.36 64.08,70.48 75.77,70.48 75.93,70.64 77.2,70.64 77.6,71.04 79.08,71.04 79.77,70.35 SLOT4.B21 81.89,70.35 81.92,70.32 83.76,70.32 83.92,70.48 95.84,70.48 96.05,70.69 97.58,70.69 97.93,71.04 99.6,71.04 100.29,70.35 SLOT3.B21 102.05,70.35 102.08,70.32 103.76,70.32 103.92,70.48 115.84,70.48 116,70.64 117.6,70.64 118,71.04 119.36,71.04 120.05,70.35 SLOT2.B21 122.05,70.35 122.08,70.32 123.92,70.32 124.08,70.48 135.68,70.48 135.92,70.72 136.45,70.72 136.48,70.69 137.02,70.69 137.05,70.72 137.56,70.72 137.88,71.04 139.2,71.04 139.89,70.35 SLOT1.B21 143.79,70.35 143.92,70.48 155.44,70.47 155.65,70.69 157.02,70.69 157.05,70.72 157.84,70.72 158.16,71.04 159.12,71.04 159.81,70.35 SLOT0.B21
  Bottom 0.152: SLOT4.B21 80.21,70.35 79.52,71.04 77.92,71.04 77.5,70.62 75.67,70.62 73.92,68.88 73.92,36.16 76,34.08 76,24.8 86,14.8 88.56,14.8 89.6,13.76 89.6,11.92 90.72,10.8 91.52,10.8 92.32,10 J10.2 92.35,7.49 92.5,7.34 R18.1
A2
  Top 0.152: SLOT7.A22 19.61,71.35 19.84,71.12 22.08,71.12 22.54,70.67 23.55,70.67 23.86,70.98 35.82,70.98 36.19,71.35 SLOT6.A22 40.01,71.35 40.32,71.04 42.1,71.04 42.48,70.67 43.78,70.67 44.08,70.96 56.21,70.96 56.6,71.35 SLOT5.A22 59.44,71.36 59.76,71.04 62.06,71.04 62.42,70.68 63.64,70.68 63.92,70.96 75.8,70.96 76.19,71.35 SLOT4.A22 79.37,71.35 79.68,71.04 82.16,71.04 82.56,70.64 83.6,70.64 83.92,70.96 95.72,70.96 96.11,71.35 SLOT3.A22 97.37,71.35 97.38,71.34 99.78,71.34 100.08,71.04 102.08,71.04 102.48,70.64 103.6,70.64 103.92,70.96 115.76,70.96 116.15,71.35 SLOT2.A22 119.68,71.36 120,71.04 122.48,71.04 122.88,70.64 123.76,70.64 124.08,70.96 135.68,70.96 136.07,71.35 SLOT1.A22 139.44,71.36 139.76,71.04 142.12,71.04 142.48,70.68 143.56,70.68 143.84,70.96 155.44,70.96 155.83,71.35 SLOT0.A22
  Bottom 0.152: SLOT4.A22 75.91,71.35 73.6,69.04 73.6,36 75.68,33.92 75.68,24.32 85.6,14.4 88.48,14.4 89.28,13.6 89.28,11.73 89.81,11.2 J10.3 89.81,7.63 90,7.44 R19.1
A3
  Top 0.152: SLOT7.B22 23.91,71.35 24.02,71.46 35.86,71.46 36.42,72.02 37.62,72.02 37.96,71.68 40.12,71.68 40.44,71.36 42.64,71.36 42.65,71.35 SLOT6.B22 43.89,71.35 43.98,71.44 55.68,71.44 56.26,72.02 57.34,72.02 57.68,71.68 59.6,71.68 59.92,71.36 SLOT5.B22 63.91,71.35 64,71.44 75.84,71.44 76.41,72.01 77.35,72.01 77.68,71.68 79.6,71.68 79.93,71.35 SLOT4.B22 83.83,71.35 83.92,71.44 95.72,71.44 96.29,72.01 97.49,72.01 97.84,71.66 99.96,71.66 100.26,71.36 102.52,71.36 102.53,71.35 SLOT3.B22 103.91,71.35 104,71.44 115.68,71.44 116.25,72.01 117.99,72.01 118.32,71.68 119.84,71.68 120.17,71.35 SLOT2.B22 123.91,71.35 124,71.44 135.68,71.44 136.25,72.01 137.63,72.01 137.96,71.68 139.8,71.68 140.12,71.36 SLOT1.B22 143.83,71.35 143.92,71.44 155.4,71.44 155.97,72.01 157.02,72.01 157.03,72 158,72 158.32,71.68 160,71.68 160.33,71.35 SLOT0.B22
  Bottom 0.152: SLOT4.B22 77.93,71.35 77.27,72.01 76.48,72.01 76.47,72 76.08,72 73.28,69.2 73.28,35.84 75.36,33.76 75.36,23.84 85.2,14 88.32,14 88.96,13.36 88.96,11.69 J10.4 87.27,7.61 87.52,7.36 87.52,6.17 R20.1
A4
  Top 0.152: SLOT7.A23 19.87,72.35 20.7,71.52 22.02,71.52 22.52,72.02 35.86,72.02 36.18,72.34 SLOT6.A23 39.97,72.35 40.64,71.68 42.12,71.68 42.46,72.02 55.78,72.02 56.1,72.34 SLOT5.A23 59.41,72.35 60.08,71.68 62.1,71.68 62.44,72.02 75.86,72.02 76.16,72.32 78.72,72.32 SLOT4.A23 79.48,72.35 80.15,71.68 82.12,71.68 82.45,72.01 83.52,72.01 83.53,72 95.75,72 96.1,72.35 SLOT3.A23 99.73,72.35 100.4,71.68 102.08,71.68 102.41,72.01 103.52,72.01 103.53,72 115.76,72 116.08,72.32 118.72,72.32 SLOT2.A23 119.65,72.35 120.32,71.68 122.4,71.68 122.73,72.01 123.52,72.01 123.53,72 135.76,72 136.08,72.32 138.72,72.32 SLOT1.A23 139.69,72.35 140.36,71.68 142.12,71.68 142.45,72.01 143.52,72.01 143.53,72 155.44,72 155.76,72.32 158.72,72.32 SLOT0.A23
  Bottom 0.152: SLOT4.A23 78.59,72.19 77.97,72.19 77.84,72.32 75.92,72.32 72.96,69.36 72.96,35.68 75.04,33.6 75.04,23.36 79.28,19.12 79.28,12.64 80.32,11.6 84.08,11.6 84.73,10.95 J10.5 84.73,8.07 85,7.8 R21.1
A5
  Top 0.152: SLOT7.B23 23.82,72.36 23.96,72.5 35.86,72.5 36.04,72.68 37.56,72.68 37.92,73.04 39.84,73.04 40.53,72.35 SLOT6.B23 43.95,72.35 44.08,72.48 55.76,72.48 55.94,72.66 57.14,72.66 57.52,73.04 59.28,73.04 59.97,72.35 SLOT5.B23 62.05,72.35 62.08,72.32 63.84,72.32 64,72.48 75.84,72.48 76.08,72.72 76.45,72.72 76.48,72.69 77.02,72.69 77.05,72.72 78,72.72 78.32,73.04 79.36,73.04 80.05,72.35 SLOT4.B23 81.89,72.35 81.92,72.32 83.92,72.32 84.08,72.48 95.76,72.48 95.96,72.68 97.48,72.68 97.84,73.04 99.68,73.04 100.37,72.35 SLOT3.B23 101.97,72.35 102,72.32 103.92,72.32 104.08,72.48 115.76,72.48 115.92,72.64 117.2,72.64 117.6,73.04 119.52,73.04 120.21,72.35 SLOT2.B23 122.45,72.35 122.48,72.32 123.84,72.32 124,72.48 135.76,72.48 135.92,72.64 137.68,72.64 138.08,73.04 139.64,73.04 140.33,72.35 SLOT1.B23 141.97,72.35 142,72.32 144.4,72.32 144.56,72.48 155.44,72.48 155.61,72.65 157.29,72.65 157.68,73.04 159.44,73.04 160.16,72.32 161.22,72.32 SLOT0.B23
  Bottom 0.152: SLOT4.B23 80.53,72.35 79.84,73.04 78.16,73.04 77.76,72.64 75.76,72.64 72.64,69.52 72.64,35.52 74.72,33.44 74.72,22.88 78.96,18.64 78.96,12.48 80.16,11.28 81.76,11.28 82.08,10.96 82.08,10.11 J10.6 82.19,8.05 82.56,7.68 82.56,6.21 R22.1
A6
  Top 0.152: SLOT7.A24 19.53,73.35 19.84,73.04 22.02,73.04 22.38,72.68 23.66,72.68 23.96,72.98 35.7,72.98 36.07,73.35 SLOT6.A24 40,73.36 40.32,73.04 42,73.04 42.36,72.68 43.72,72.68 44.02,72.98 55.7,72.98 56.07,73.35 SLOT5.A24 59.53,73.35 59.84,73.04 62.18,73.04 62.58,72.64 63.6,72.64 63.92,72.96 75.68,72.96 76.07,73.35 SLOT4.A24 79.53,73.35 79.87,73.01 82.19,73.01 82.55,72.64 83.6,72.64 83.92,72.96 95.72,72.96 96.11,73.35 SLOT3.A24 97.43,73.35 97.44,73.36 100,73.36 100.32,73.04 102.04,73.04 102.44,72.64 103.68,72.64 104,72.96 115.8,72.96 116.19,73.35 SLOT2.A24 117.43,73.35 117.44,73.36 119.68,73.36 120,73.04 122.56,73.04 122.96,72.64 123.6,72.64 123.92,72.96 135.76,72.96 136.16,73.36 SLOT1.A24 137.51,73.35 137.52,73.36 139.92,73.36 140.24,73.04 142.04,73.04 142.44,72.64 144.08,72.64 144.4,72.96 155.68,72.96 156.08,73.36 SLOT0.A24
  Bottom 0.152: SLOT4.A24 75.99,73.35 72.32,69.68 72.32,35.36 74.4,33.28 74.4,22.4 78.64,18.16 78.64,12.29 79.65,11.28 J10.7 79.65,8.03 80,7.68 R23.1
A7
  Top 0.152: SLOT7.B24 23.99,73.35 24.12,73.48 35.64,73.48 36.18,74.02 37.58,74.02 37.92,73.68 40.12,73.68 40.45,73.35 SLOT6.B24 43.91,73.35 44.04,73.48 55.72,73.48 56.25,74.01 57.59,74.01 57.92,73.68 59.76,73.68 60.08,73.36 SLOT5.B24 63.91,73.35 64,73.44 75.6,73.44 76.17,74.01 77.75,74.01 78.08,73.68 80.48,73.68 80.81,73.35 SLOT4.B24 83.91,73.35 84,73.44 95.76,73.44 96.32,74 96.47,74 96.48,74.01 97.59,74.01 97.92,73.68 100.16,73.68 100.48,73.36 SLOT3.B24 103.83,73.35 103.92,73.44 115.84,73.44 116.41,74.01 117.91,74.01 118.24,73.68 119.84,73.68 120.16,73.36 SLOT2.B24 123.83,73.35 123.92,73.44 135.76,73.44 136.32,74 136.47,74 136.48,74.01 137.02,74.01 137.03,74 137.72,74 138.04,73.68 140.24,73.68 140.57,73.35 SLOT1.B24 143.75,73.35 143.92,73.52 155.76,73.52 156.25,74.01 157.02,74.01 157.03,74 158.08,74 158.4,73.68 159.68,73.68 160.01,73.35 SLOT0.B24
  Bottom 0.152: SLOT4.B24 78.01,73.35 77.32,74.04 76.2,74.04 72,69.84 72,35.2 74.08,33.12 74.08,21.92 78.31,17.69 78.31,12.32 77.11,11.12 J10.8 77.11,8.17 77.5,7.78 R24.1
A8
  Top 0.152: SLOT7.A25 19.71,74.35 20.62,73.44 21.96,73.44 22.54,74.02 35.62,74.02 35.94,74.34 SLOT6.A25 39.41,74.35 39.77,73.98 40.25,73.98 40.55,73.68 42.06,73.68 42.38,74 42.97,74 42.98,74.01 55.69,74.01 56,74.32 57.79,74.32 57.86,74.26 58.66,74.26 SLOT5.A25 59.65,74.35 60.32,73.68 62.14,73.68 62.48,74.02 75.74,74.02 76.04,74.32 78.72,74.32 SLOT4.A25 79.17,74.35 79.53,73.98 80.61,73.98 80.91,73.68 82.16,73.68 82.49,74.01 83.52,74.01 83.53,74 95.84,74 96.16,74.32 97.84,74.32 97.87,74.35 SLOT3.A25 99.97,74.35 100.64,73.68 102.12,73.68 102.44,74 102.97,74 102.98,74.01 103.52,74.01 103.53,74 115.75,74 116.07,74.32 118.72,74.32 SLOT2.A25 119.65,74.35 120.32,73.68 121.84,73.68 122.17,74.01 123.52,74.01 123.53,74 135.84,74 136.16,74.32 138.72,74.32 SLOT1.A25 139.17,74.35 139.52,74 140.56,74 140.88,73.68 142.12,73.68 142.45,74.01 143.52,74.01 143.53,74 155.76,74 156.08,74.32 158.72,74.32 SLOT0.A25
  Bottom 0.152: SLOT4.A25 77.81,74.35 77.8,74.36 75.12,74.36 71.2,70.44 71.2,34.88 73.36,32.72 73.36,23.76 69.44,19.84 69.44,18.45 J11.1 72.89,8.41 72.48,8 72.48,6.17 R25.1
A9
  Top 0.152: SLOT7.B25 21.81,74.35 21.82,74.34 23.92,74.34 24.08,74.5 35.54,74.5 35.7,74.66 37.62,74.66 38,75.04 39.2,75.04 39.89,74.35 SLOT6.B25 41.89,74.35 41.92,74.32 44,74.32 44.2,74.52 55.64,74.52 55.76,74.64 57.84,74.64 58.24,75.04 59.44,75.04 60.13,74.35 SLOT5.B25 61.94,74.35 61.95,74.33 63.85,74.33 64.06,74.54 75.82,74.54 75.97,74.69 77.65,74.69 77.97,75.01 79.02,75.01 79.68,74.35 SLOT4.B25 81.97,74.35 82,74.32 83.84,74.32 84,74.48 95.84,74.48 96,74.64 97.52,74.64 97.92,75.04 99.76,75.04 100.45,74.35 SLOT3.B25 101.29,74.31 102.05,74.31 102.04,74.32 103.84,74.32 104,74.48 115.76,74.48 115.92,74.64 117.04,74.64 117.44,75.04 119.76,75.04 120.45,74.35 SLOT2.B25 122.69,74.35 122.72,74.32 123.76,74.32 123.92,74.48 135.84,74.48 136,74.64 137.48,74.64 137.88,75.04 139.2,75.04 139.89,74.35 SLOT1.B25 141.97,74.35 142,74.32 143.84,74.32 144,74.48 155.76,74.48 155.92,74.64 157.12,74.64 157.52,75.04 159.44,75.04 160.13,74.35 SLOT0.B25
  Bottom 0.152: SLOT4.B25 80.53,74.35 79.84,75.04 78.08,75.04 77.72,74.68 75,74.68 70.88,70.56 70.88,34.72 73.04,32.56 73.04,24.24 68.24,19.44 68.24,17.11 J11.2 70.35,8.59 69.92,8.16 69.92,6.23 R26.1
A10
  Top 0.152: SLOT7.A26 19.53,75.35 19.76,75.12 22.02,75.12 22.48,74.66 23.66,74.66 24,75 35.8,75 36.08,75.28 36.68,75.28 SLOT6.A26 39.41,75.36 39.73,75.04 42.04,75.04 42.44,74.64 43.76,74.64 44.16,75.04 55.44,75.04 55.75,75.35 SLOT5.A26 59.66,75.35 59.99,75.02 62.16,75.02 62.52,74.66 63.7,74.66 64.06,75.02 75.82,75.02 76.16,75.36 SLOT4.A26 79.21,75.35 79.52,75.04 82.08,75.04 82.48,74.64 83.68,74.64 84,74.96 95.76,74.96 96.15,75.35 SLOT3.A26 97.83,75.35 97.84,75.36 100.08,75.36 100.4,75.04 102.12,75.04 102.52,74.64 103.64,74.64 103.96,74.96 115.8,74.96 116.19,75.35 SLOT2.A26 118.07,75.35 118.08,75.36 120,75.36 120.32,75.04 122.56,75.04 122.96,74.64 123.6,74.64 123.92,74.96 135.8,74.96 136.19,75.35 SLOT1.A26 137.51,75.35 137.52,75.36 139.44,75.36 139.76,75.04 142.16,75.04 142.56,74.64 143.68,74.64 144,74.96 155.8,74.96 156.19,75.35 SLOT0.A26
  Bottom 0.152: SLOT4.A26 75.19,75.35 70.56,70.72 70.56,34.56 72.72,32.4 72.72,24.72 66.8,18.8 66.8,16.01 J11.3 67.81,8.93 67.36,8.48 67.36,6.29 R27.1
A11
  Top 0.152: SLOT7.B26 23.83,75.35 23.96,75.48 35.72,75.48 36.26,76.02 37.54,76.02 37.88,75.68 39.52,75.68 39.84,75.36 SLOT6.B26 43.91,75.35 44.08,75.52 55.44,75.52 55.93,76.01 57.19,76.01 57.52,75.68 59.76,75.68 60.11,75.33 63.23,75.33 SLOT5.B26 63.83,75.35 63.98,75.5 75.82,75.5 76.33,76.01 77.63,76.01 77.96,75.68 79.4,75.68 79.73,75.35 SLOT4.B26 83.91,75.35 84,75.44 95.75,75.44 96.32,76.01 97.67,76.01 98,75.68 100.24,75.68 100.56,75.36 SLOT3.B26 103.83,75.35 103.92,75.44 115.84,75.44 116.41,76.01 118.07,76.01 118.4,75.68 120.16,75.68 120.48,75.36 SLOT2.B26 123.83,75.35 123.92,75.44 135.84,75.44 136.41,76.01 137.63,76.01 137.96,75.68 139.6,75.68 139.92,75.36 SLOT1.B26 143.91,75.35 144.08,75.52 155.88,75.52 156.37,76.01 157.99,76.01 158.32,75.68 162.92,75.68 SLOT0.B26
  Bottom 0.152: SLOT4.B26 79.61,75.35 79.28,75.68 77.96,75.68 77.62,76.02 75.38,76.02 70.24,70.88 70.24,34.4 72.4,32.24 72.4,25.2 65.27,18.07 J11.4 65.27,8.47 64.96,8.16 64.96,6.19 R28.1
A12
  Top 0.152: SLOT7.A27 19.71,76.35 20.54,75.52 21.98,75.52 22.48,76.02 35.78,76.02 36.1,76.34 SLOT6.A27 39.41,76.35 40.08,75.68 42.06,75.68 42.4,76.02 55.51,76.02 55.8,76.31 58.71,76.31 SLOT5.A27 59.17,76.35 59.53,75.98 59.89,75.98 60.19,75.68 62.14,75.68 62.47,76.01 63.52,76.01 63.53,76 75.76,76 76.11,76.35 SLOT4.A27 79.61,76.35 80.28,75.68 82.16,75.68 82.49,76.01 83.52,76.01 83.53,76 95.79,76 96.11,76.32 98.72,76.32 SLOT3.A27 100.13,76.35 100.8,75.68 102.08,75.68 102.41,76.01 103.52,76.01 103.53,76 115.92,76 116.24,76.32 118.72,76.32 SLOT2.A27 119.97,76.35 120.64,75.68 121.92,75.68 122.25,76.02 123.75,76.02 123.76,76 135.84,76 136.19,76.35 SLOT1.A27 139.49,76.35 140.16,75.68 142.16,75.68 142.49,76.01 143.52,76.01 143.53,76 155.87,76 156.19,76.32 158.56,76.32 158.59,76.35 SLOT0.A27
  Bottom 0.152: SLOT4.A27 75.24,76.36 69.92,71.04 69.92,34.4 67.36,31.84 67.36,21.76 61.84,16.24 61.84,15.89 J11.5 62.73,8.33 62.5,8.1 R29.1
A13
  Top 0.152: SLOT7.B27 23.97,76.35 24.1,76.48 35.76,76.48 35.96,76.68 37.6,76.68 37.96,77.04 39.44,77.04 40.13,76.35 SLOT6.B27 41.41,76.19 42.01,76.19 42.16,76.34 43.94,76.34 44.08,76.48 55.52,76.48 55.68,76.64 57.84,76.64 58.24,77.04 59.12,77.04 59.81,76.35 SLOT5.B27 62.03,76.35 62.06,76.32 63.92,76.32 64.08,76.48 75.76,76.48 75.97,76.69 77.61,76.69 77.93,77.01 79.67,77.01 80.33,76.35 SLOT4.B27 81.89,76.35 81.92,76.32 83.88,76.32 84.04,76.48 95.72,76.48 95.88,76.64 97.56,76.64 97.96,77.04 99.09,77.04 99.39,76.73 100.22,76.73 100.61,76.35 SLOT3.B27 101.97,76.35 102,76.32 103.92,76.32 104.08,76.48 115.92,76.48 116.13,76.69 117.02,76.69 117.37,77.04 119.84,77.04 120.53,76.35 SLOT2.B27 122.13,76.35 122.16,76.32 123.84,76.32 124,76.48 135.84,76.48 136.04,76.68 137.6,76.68 137.96,77.04 139.36,77.04 140.05,76.35 SLOT1.B27 142.01,76.35 142.04,76.32 143.92,76.32 144.08,76.48 155.84,76.48 156,76.64 157.36,76.64 157.76,77.04 159.92,77.04 160.61,76.35 SLOT0.B27
  Bottom 0.152: SLOT4.B27 80.45,76.35 79.68,77.12 78.04,77.12 77.6,76.68 75.08,76.68 69.6,71.2 69.6,34.56 67.04,32 67.04,22.24 60.19,15.39 J11.6 60.19,9.31 60,9.12 R30.1
A14
  Top 0.152: SLOT7.A28 19.53,77.35 19.84,77.04 22.1,77.04 22.46,76.68 23.72,76.68 24,76.96 35.76,76.96 36.16,77.36 SLOT6.A28 39.6,77.36 39.94,77.02 42.1,77.02 42.46,76.66 43.7,76.66 44,76.96 55.44,76.96 55.83,77.35 SLOT5.A28 59.68,77.36 60,77.04 62.06,77.04 62.46,76.64 63.68,76.64 64,76.96 75.68,76.96 76.07,77.35 SLOT4.A28 79.84,77.36 80.16,77.04 82.12,77.04 82.52,76.64 83.68,76.64 84,76.96 95.72,76.96 96.11,77.35 SLOT3.A28 99.21,77.35 99.52,77.04 102.12,77.04 102.52,76.64 103.68,76.64 104,76.96 115.84,76.96 116.23,77.35 SLOT2.A28 120.24,77.36 120.56,77.04 122.56,77.04 122.96,76.64 123.6,76.64 123.92,76.96 135.84,76.96 136.23,77.35 SLOT1.A28 139.68,77.36 140,77.04 142.4,77.04 142.8,76.64 143.68,76.64 144,76.96 155.88,76.96 156.27,77.35 SLOT0.A28
  Bottom 0.152: SLOT4.A28 75.27,77.35 69.28,71.36 69.28,34.72 66.72,32.16 66.72,22.72 61.36,17.36 58.64,17.36 57.65,16.37 J11.7 57.65,9.33 57.44,9.12 57.44,6.21 R31.1
A15
  Top 0.152: SLOT7.B28 23.91,77.35 24.04,77.48 35.8,77.48 36.34,78.02 37.58,78.02 37.92,77.68 39.84,77.68 40.17,77.35 SLOT6.B28 43.99,77.35 44.14,77.5 55.5,77.5 56.01,78.01 57.02,78.01 57.11,77.92 57.92,77.92 58.16,77.68 59.84,77.68 60.16,77.36 SLOT5.B28 63.83,77.35 63.92,77.44 75.6,77.44 76.17,78.01 77.63,78.01 77.96,77.68 80,77.68 80.33,77.35 SLOT4.B28 83.83,77.35 83.92,77.44 95.68,77.44 96.25,78.01 97.63,78.01 97.96,77.68 99.36,77.68 99.68,77.36 102.84,77.36 102.85,77.35 SLOT3.B28 103.83,77.35 103.92,77.44 115.84,77.44 116.41,78.01 117.02,78.01 117.03,78 118,78 118.32,77.68 120.4,77.68 120.72,77.36 SLOT2.B28 123.89,77.35 123.98,77.44 135.84,77.44 136.41,78.01 137.02,78.01 137.03,78 137.64,78 137.96,77.68 139.84,77.68 140.16,77.36 SLOT1.B28 143.99,77.35 144.08,77.44 155.84,77.44 156.41,78.01 158.07,78.01 158.4,77.68 162.92,77.68 SLOT0.B28
  Bottom 0.152: SLOT4.B28 80.33,77.35 80.24,77.44 78.2,77.44 77.63,78.01 76.48,78.01 76.47,78 75.44,78 68.96,71.52 68.96,34.88 66.4,32.32 66.4,23.2 61.44,18.24 57.12,18.24 55.11,16.23 J11.8 55.11,9.35 55,9.24 R32.1
A16
  Top 0.152: SLOT7.A29 19.71,78.35 20.54,77.52 22.02,77.52 22.52,78.02 35.82,78.02 36.16,78.36 SLOT6.A29 39.65,78.35 40.32,77.68 42.17,77.68 42.51,78.02 55.53,78.02 55.84,78.32 58.72,78.32 SLOT5.A29 59.61,78.35 60.28,77.68 62.06,77.68 62.39,78.01 63.52,78.01 63.53,78 75.6,78 75.94,78.33 78.05,78.33 78.06,78.35 SLOT4.A29 79.89,78.35 80.56,77.68 82.04,77.68 82.4,78.04 83.76,78.04 83.8,78 95.68,78 96,78.32 98.72,78.32 SLOT3.A29 99.25,78.35 99.92,77.68 102.08,77.68 102.41,78.01 103.52,78.01 103.53,78 115.84,78 116.16,78.32 118.72,78.32 SLOT2.A29 119.53,78.35 119.88,78 120.56,78 120.88,77.68 122.12,77.68 122.45,78.01 123.52,78.01 123.53,78 135.76,78 136.08,78.32 138.72,78.32 SLOT1.A29 139.65,78.35 140.32,77.68 142.04,77.68 142.4,78.04 143.68,78.04 143.72,78 155.92,78 156.24,78.32 158.72,78.32 SLOT0.A29
  Bottom 0.152: SLOT4.A29 78.07,78.35 78.04,78.32 74.4,78.32 68.16,72.08 68.16,35.2 65.6,32.64 65.6,26.57 58.39,19.36 51.84,19.36 47.12,14.64 47.12,12.57 48.01,11.68 49.21,11.68 J12.1 50.89,8.01 50.5,7.62 R33.1
A17
  Top 0.152: SLOT7.B29 23.71,78.35 23.9,78.54 35.84,78.54 35.98,78.68 37.56,78.68 37.92,79.04 39.52,79.04 40.24,78.32 41.22,78.32 SLOT6.B29 41.28,78.32 43.92,78.32 44.08,78.48 55.52,78.48 55.68,78.64 57.52,78.64 57.92,79.04 59.4,79.04 60.09,78.35 SLOT5.B29 61.89,78.35 61.92,78.32 64,78.32 64.16,78.48 75.52,78.48 75.68,78.64 77.52,78.64 77.92,79.04 79.72,79.04 80.41,78.35 SLOT4.B29 83.83,78.35 83.96,78.48 95.68,78.48 95.89,78.69 97.53,78.69 97.88,79.04 99.73,79.04 100.35,78.42 101.19,78.42 SLOT3.B29 102.05,78.35 102.08,78.32 103.84,78.32 104,78.48 115.84,78.48 116,78.64 117.44,78.64 117.84,79.04 119.56,79.04 120.25,78.35 SLOT2.B29 122.09,78.35 122.12,78.32 124,78.32 124.16,78.48 135.76,78.48 136,78.72 136.45,78.72 136.48,78.69 137.02,78.69 137.05,78.72 137.6,78.72 137.92,79.04 139.52,79.04 140.24,78.32 141.22,78.32 SLOT1.B29 141.97,78.35 141.96,78.36 143.88,78.36 144,78.48 155.84,78.48 156,78.64 157.92,78.64 158.32,79.04 159.28,79.04 159.92,78.4 161.2,78.4 SLOT0.B29
  Bottom 0.152: SLOT4.B29 80.56,79.04 77.92,79.04 77.52,78.64 74.24,78.64 67.84,72.24 67.84,35.36 65.28,32.8 65.28,27.04 57.92,19.68 51.68,19.68 46.8,14.8 46.8,11.55 J12.2 48.35,8.03 48,7.68 R34.1
A18
  Top 0.152: SLOT7.A30 19.37,79.35 19.68,79.04 22.16,79.04 22.54,78.66 23.54,78.66 23.9,79.02 35.86,79.02 36.2,79.36 SLOT6.A30 | SLOT6.A30 | SLOT6.A30 39.84,79.36 40.16,79.04 42.08,79.04 42.48,78.64 43.68,78.64 44,78.96 55.52,78.96 55.92,79.36 SLOT5.A30 59.55,79.35 59.86,79.04 62.06,79.04 62.46,78.64 63.76,78.64 64.08,78.96 75.84,78.96 76.24,79.36 SLOT4.A30 79.88,79.36 80.2,79.04 82.08,79.04 82.43,78.69 83.68,78.69 83.95,78.96 95.72,78.96 96.11,79.35 SLOT3.A30 100,79.36 100.32,79.04 102.04,79.04 102.44,78.64 103.64,78.64 103.96,78.96 115.8,78.96 116.19,79.35 SLOT2.A30 119.84,79.36 120.16,79.04 122.12,79.04 122.47,78.69 123.81,78.69 124.08,78.96 135.76,78.96 136.15,79.35 SLOT1.A30 139.77,79.35 140.08,79.04 142.08,79.04 142.45,78.67 143.63,78.67 143.92,78.96 155.76,78.96 156.15,79.35 SLOT0.A30
  Bottom 0.152: SLOT4.A30 74.39,79.35 67.52,72.48 67.52,35.52 64.96,32.96 64.96,27.52 57.44,20 51.52,20 46.48,14.96 46.48,12.67 45.81,12 J12.3 45.81,8.21 45.44,7.84 45.44,6.21 R35.1
A19
  Top 0.152: SLOT7.B30 23.84,79.36 24,79.52 35.88,79.52 36.37,80.01 37.59,80.01 37.92,79.68 40.08,79.68 40.4,79.36 SLOT6.B30 44,79.36 44.08,79.44 55.44,79.44 56.01,80.01 57.19,80.01 57.44,79.68 59.7,79.68 60.02,79.36 SLOT5.B30 63.92,79.36 64.06,79.5 75.82,79.5 76.33,80.01 77.51,80.01 77.84,79.68 80.04,79.68 80.36,79.36 SLOT4.B30 83.83,79.35 83.92,79.44 95.72,79.44 96.29,80.01 97.59,80.01 97.92,79.68 100.32,79.68 100.64,79.36 SLOT3.B30 103.83,79.35 103.92,79.44 115.76,79.44 116.33,80.01 117.02,80.01 117.03,80 118,80 118.32,79.68 120.04,79.68 120.36,79.36 SLOT2.B30 123.91,79.35 124,79.44 135.78,79.44 136.34,80 136.47,80 136.48,80.01 137.02,80.01 137.03,80 137.56,80 137.88,79.68 140.04,79.68 140.36,79.36 SLOT1.B30 143.83,79.35 143.92,79.44 155.76,79.44 156.33,80.01 157.99,80.01 158.32,79.68 162.92,79.68 SLOT0.B30
  Bottom 0.152: SLOT4.B30 78.17,79.35 77.48,80.04 74.6,80.04 67.2,72.64 67.2,35.68 64.64,33.12 64.64,28.01 56.95,20.32 51.36,20.32 46.16,15.12 46.16,12.89 J12.4 43.27,7.91 42.88,7.52 42.88,6.27 R36.1
A20
  Top 0.152: SLOT7.A31 19.73,80.35 20.48,79.6 22.1,79.6 22.52,80.02 35.9,80.02 36.2,80.32 38.72,80.32 SLOT6.A31 40.03,80.35 40.7,79.68 42.1,79.68 42.44,80.02 55.54,80.02 55.84,80.32 58.72,80.32 SLOT5.A31 59.05,80.35 59.37,80.03 59.85,80.03 60.2,79.68 62.14,79.68 62.48,80.02 75.78,80.02 76.08,80.32 78.72,80.32 SLOT4.A31 79.93,80.35 80.6,79.68 81.68,79.68 82.01,80.01 95.8,80.01 96.11,80.32 98.72,80.32 SLOT3.A31 100.13,80.35 100.8,79.68 102.12,79.68 102.45,80.01 103.52,80.01 103.53,80 115.6,80 115.96,80.36 SLOT2.A31 119.89,80.35 120.55,79.69 122.09,79.69 122.41,80.01 123.52,80.01 123.53,80 135.83,80 136.18,80.35 SLOT1.A31 139.89,80.35 140.56,79.68 142.12,79.68 142.45,80.01 143.52,80.01 143.53,80 155.84,80 156.16,80.32 158.72,80.32 SLOT0.A31
  Bottom 0.152: SLOT4.A31 74.43,80.35 66.88,72.8 66.88,35.84 64.32,33.28 64.32,28.48 56.48,20.64 42.4,20.64 37.45,15.69 37.45,13.36 40.73,10.08 J12.5 40.73,8.41 40.48,8.16 40.48,6.17 R37.1
A21
  Top 0.152: SLOT7.B31 24.03,80.35 24.16,80.48 35.86,80.48 36.02,80.64 37.56,80.64 37.96,81.04 39.04,81.04 39.33,80.75 40.85,80.75 SLOT6.B31 44.27,80.35 44.4,80.48 55.52,80.48 55.68,80.64 57.76,80.64 58.14,81.02 59.06,81.02 59.57,80.51 60.19,80.51 60.35,80.35 SLOT5.B31 64.03,80.35 64.16,80.48 75.68,80.48 75.88,80.68 77.52,80.68 77.88,81.04 79,81.04 79.21,80.83 80.77,80.83 SLOT4.B31 84.03,80.35 84.16,80.48 95.8,80.48 95.97,80.65 97.53,80.65 97.92,81.04 99,81.04 99.17,80.87 100.73,80.87 SLOT3.B31 102.05,80.35 102.08,80.32 103.92,80.32 104.08,80.48 115.6,80.48 115.8,80.68 117.72,80.68 118.08,81.04 119.04,81.04 119.21,80.87 119.85,80.87 120.37,80.35 SLOT2.B31 121.28,80.32 124.08,80.32 124.24,80.48 135.84,80.48 136.04,80.68 137.52,80.68 137.88,81.04 139,81.04 139.33,80.71 140.13,80.71 140.49,80.35 SLOT1.B31 142.37,80.35 142.4,80.32 143.92,80.32 144.08,80.48 155.84,80.48 156,80.64 157.36,80.64 157.84,81.12 160.48,81.12 SLOT0.B31
  Bottom 0.152: SLOT4.B31 81.09,80.51 80.05,80.51 79.52,81.04 77.88,81.04 77.52,80.68 74.28,80.68 66.56,72.96 66.56,36 64,33.44 64,28.96 55.98,20.95 42.23,20.95 37.07,15.79 37.07,13.28 38.19,12.16 J12.6 38.19,7.79 38,7.6 R38.1
A22
  Top 0.152: SLOT7.A32 21.69,81.35 22.36,80.68 23.88,80.68 24.16,80.96 35.82,80.96 36.21,81.35 SLOT6.A32 36.83,81.43 39.09,81.43 39.4,81.12 42.1,81.12 42.54,80.68 43.96,80.68 44.24,80.96 55.52,80.96 55.91,81.35 SLOT5.A32 57.77,81.35 57.78,81.34 59.18,81.34 59.52,81 60.76,81 60.88,81.12 62.04,81.12 62.5,80.66 63.78,80.66 64.08,80.96 75.68,80.96 76.07,81.35 SLOT4.A32 79.2,81.35 79.39,81.16 81.72,81.16 82.2,80.68 83.72,80.68 84,80.96 95.76,80.96 96.15,81.35 SLOT3.A32 99.15,81.35 99.3,81.2 102.04,81.2 102.6,80.64 103.72,80.64 104.04,80.96 115.52,80.96 115.91,81.35 SLOT2.A32 119.16,81.36 119.32,81.2 121.99,81.2 122.55,80.64 123.92,80.64 124.24,80.96 135.84,80.96 136.23,81.35 SLOT1.A32 139.16,81.36 139.48,81.04 142.4,81.04 142.8,80.64 143.6,80.64 143.92,80.96 155.76,80.96 156.15,81.35 SLOT0.A32
  Bottom 0.152: SLOT4.A32 74.47,81.35 66.24,73.12 66.24,36.16 63.68,33.6 63.68,29.44 55.52,21.28 42.08,21.28 36.69,15.89 36.69,13.2 35.65,12.16 J12.7 35.65,7.65 35.5,7.5 R39.1
A23
  Top 0.152: SLOT7.B32 23.91,81.35 24,81.44 35.76,81.44 36.33,82.01 37.67,82.01 37.93,81.75 39.21,81.75 39.45,81.51 43.09,81.51 SLOT6.B32 43.91,81.35 44,81.44 55.52,81.44 56.09,82.01 57.67,82.01 58.03,81.65 59.31,81.65 59.56,81.4 60.34,81.4 60.44,81.5 63.1,81.5 SLOT5.B32 63.91,81.35 64,81.44 75.6,81.44 76.17,82.01 77.67,82.01 78.01,81.67 79.37,81.67 79.53,81.51 83.09,81.51 SLOT4.B32 84.07,81.35 84.16,81.44 95.72,81.44 96.29,82.01 97.51,82.01 97.84,81.68 99.28,81.68 99.45,81.51 103.09,81.51 SLOT3.B32 103.83,81.35 103.92,81.44 115.44,81.44 116.01,82.01 117.15,82.01 117.49,81.67 117.75,81.67 117.76,81.68 119.28,81.68 119.44,81.52 123.09,81.51 SLOT2.B32 123.83,81.35 123.92,81.44 135.76,81.44 136.33,82.01 137.02,82.01 137.03,82 137.56,82 137.89,81.67 139.33,81.67 139.65,81.35 SLOT1.B32 143.83,81.35 143.92,81.44 155.68,81.44 156.25,82.01 157.19,82.01 157.68,81.52 160.68,81.52 161.44,81.52 161.61,81.35 SLOT0.B32
  Bottom 0.152: SLOT4.B32 83.09,81.51 78.17,81.51 77.64,82.04 74.68,82.04 65.92,73.28 65.92,36.32 63.36,33.76 63.36,29.92 55.04,21.6 41.92,21.6 36.31,15.99 36.31,13.28 33.11,10.08 J12.8 33.11,7.83 32.96,7.68 32.96,6.19 R40.1
AUX0
  Top 0.152: SLOT7.A2 19.63,49.35 19.86,49.12 22.08,49.12 22.56,48.64 23.52,48.64 24.23,49.35 SLOT6.A2 39.63,49.35 40.03,48.95 40.75,48.95 40.84,49.04 41.6,49.04 41.69,48.95 41.93,48.95 42.24,48.64 43.52,48.64 44.26,49.38 56.7,49.38 56.73,49.35 SLOT5.A2 59.44,49.36 59.76,49.04 62.24,49.04 62.64,48.64 63.6,48.64 64.32,49.36 76.5,49.36 76.51,49.35 SLOT4.A2 77.75,49.35 77.76,49.36 79.44,49.36 79.84,48.96 80.32,48.96 80.4,49.04 82.24,49.04 82.64,48.64 83.68,48.64 84.4,49.36 96.16,49.36 96.17,49.35 SLOT3.A2 99.52,49.36 99.84,49.04 102.08,49.04 102.48,48.64 103.52,48.64 104.23,49.35 SLOT2.A2 119.61,49.35 119.92,49.04 122.4,49.04 122.8,48.64 123.6,48.64 124.31,49.35 SLOT1.A2 139.68,49.36 140,49.04 142.08,49.04 142.48,48.64 143.68,48.64 144.24,49.2 155.84,49.2 156.01,49.38 156.71,49.38 156.73,49.35 SLOT0.A2
  Bottom 0.152: SLOT0.A2 155.75,49.35 154.56,48.16 154.56,26.08 157.76,22.88 160.96,22.88 168.84,15 J14.1 168.5,14.61 R49.1
AUX1
  Top 0.152: SLOT7.B2 23.57,49.67 36.07,49.67 36.41,50.01 37.19,50.01 37.53,49.67 39.77,49.67 40.09,49.35 SLOT6.B2 43.76,49.36 44.1,49.7 56.1,49.7 56.41,50.01 57.59,50.01 57.92,49.68 59.6,49.68 59.92,49.36 SLOT5.B2 63.83,49.35 64.16,49.68 76,49.68 76.32,50 76.48,50 76.49,50.01 77.02,50.01 77.03,50 78,50 78.32,49.68 79.68,49.68 80,49.36 SLOT4.B2 83.91,49.35 84.24,49.68 96.08,49.68 96.4,50 96.47,50 96.48,50.01 97.02,50.01 97.03,50 97.6,50 97.92,49.68 99.76,49.68 100.08,49.36 SLOT3.B2 103.35,49.35 103.68,49.68 116.08,49.68 116.42,50.02 117.57,50.02 117.91,49.68 119.84,49.68 120.17,49.35 SLOT2.B2 123.83,49.35 124.16,49.68 136,49.68 136.33,50.01 137.51,50.01 137.84,49.68 139.92,49.68 140.24,49.36 SLOT1.B2 143.89,49.35 144.06,49.52 155.68,49.52 156.18,50.02 157.74,50.02 158.4,49.36 SLOT0.B2
  Bottom 0.152: SLOT0.B2 158.01,49.35 157.34,50.02 154.66,50.02 154.24,49.6 154.24,25.92 157.6,22.56 160.8,22.56 166.35,17.01 J14.2 166,14.65 R50.1
AUX2
  Top 0.152: SLOT7.A3 19.71,50.35 20.46,49.6 22.08,49.6 22.48,50 23,50 23.04,50.04 23.44,50.04 23.48,50 35.92,50 36.24,50.32 38.72,50.32 SLOT6.A3 39.57,50.35 40.24,49.68 41.92,49.68 42.26,50.02 55.94,50.02 56.24,50.32 58.72,50.32 SLOT5.A3 59.41,50.35 60.08,49.68 62.24,49.68 62.56,50 62.97,50 62.98,50.01 63.52,50.01 63.53,50 75.84,50 76.16,50.32 78.72,50.32 SLOT4.A3 79.57,50.35 80.24,49.68 82.24,49.68 82.57,50.01 95.93,50.01 96.24,50.32 98.72,50.32 SLOT3.A3 99.73,50.35 100.4,49.68 102.08,49.68 102.42,50.02 103.67,50.02 103.68,50 115.92,50 116.26,50.34 118.5,50.34 118.51,50.35 SLOT2.A3 119.65,50.35 120.32,49.68 122.08,49.68 122.41,50.01 123.52,50.01 123.53,50 135.84,50 136.16,50.32 138.72,50.32 SLOT1.A3 139.81,50.35 140.48,49.68 142.08,49.68 142.41,50.01 143.52,50.01 143.53,50 143.76,50 143.92,49.84 155.52,49.84 156.02,50.34 SLOT0.A3
  Bottom 0.152: SLOT0.A3 158.59,50.19 157.97,50.19 157.82,50.34 154.55,50.34 153.92,49.71 153.92,25.76 157.44,22.24 160.64,22.24 164.61,18.27 164.61,15.8 J14.3 163.5,14.69 R51.1
AUX3